# EAGLE design LPS25H_breakout (EAGLE 7.2.0)
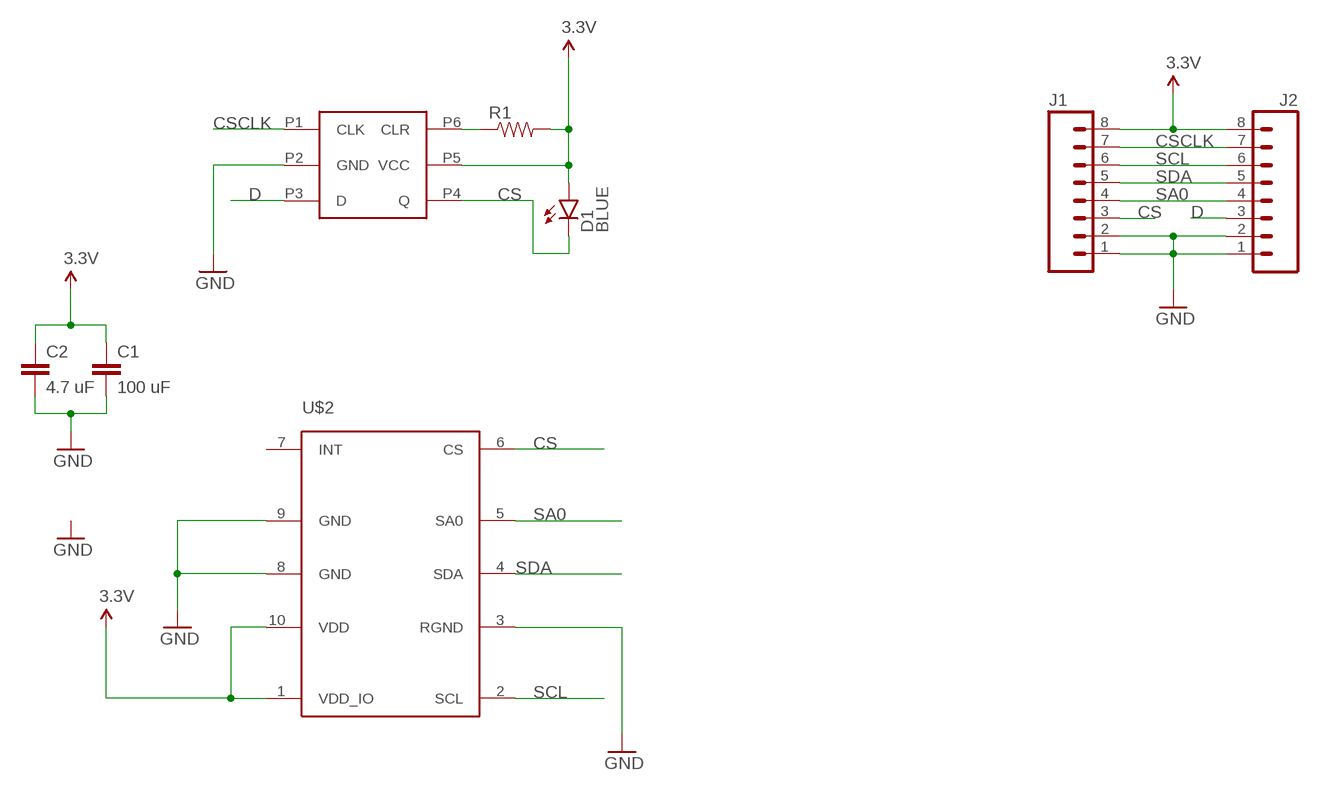
[diagram p0: schematic, sheet 1]

## Parts
C1  100 uF  CAP0603-CAP  [0603-CAP]
C2  4.7 uF  CAP0603-CAP  [0603-CAP]
D1  BLUE  LED-BLUE0603  [LED-0603]
J1  M08BM08B-SRSS-TB  [BM08B-SRSS-TB]
J2  M08BM08B-SRSS-TB  [BM08B-SRSS-TB]
R1  RESISTOR0603-RES  [0603-RES]
U$1  SN74LVC1G175  [SN74LVC1G175]
U$2  LPS25H  [LPS25H]

## Nets
3.3V: C1.1 C2.1 D1.A J1.8 J2.8 R1.2 U$1.P5(VCC) U$2.1(VDD_IO) U$2.10(VDD)
CS: D1.C J1.3 U$1.P4(Q) U$2.6(CS)
CSCLK: J1.7 J2.7 U$1.P1(CLK)
D: J2.3 U$1.P3(D)
GND: C1.2 C2.2 J1.1 J1.2 J2.1 J2.2 U$1.P2(GND) U$2.3(RGND) U$2.8(GND) U$2.9(GND)
N$1: R1.1 U$1.P6(CLR)
SA0: J1.4 J2.4 U$2.5(SA0)
SCL: J1.6 J2.6 U$2.2(SCL)
SDA: J1.5 J2.5 U$2.4(SDA)
Unconnected: U$2.7(INT)

## Library data of the parts
C1 C2 = SparkFun-Passives:CAP: Capacitor Standard 0603 ceramic capacitor, and 0.1" leaded capacitor.
D1 = SparkFun-LED:LED-BLUE: Blue LEDs for production use Various blue LEDs stocked by SparkFun production 0603 - DIO-08575 Rebel - DIO-09553 1206 - DIO-09911; PROD_ID: DIO-08575
J1 J2 = SparkFun-Connectors:M08: Header 8 Standard 8-pin 0.1" header. Use with straight break away headers (SKU : PRT-00116), right angle break away headers (PRT-00553), swiss pins (PRT-00743), machine pins (PRT-00117), and female headers (PRT-00115).
R1 = SparkFun-Passives:RESISTOR: Resistor Basic schematic elements and footprints for 0603, 1206, and PTH resistors.
U$1 = CSL_Components:SN74LVC1G175
U$2 = chips:LPS25H: ST-Micro Piezoresistive pressure sensor; DIGIKEY: 497-15070-1-ND

## Board
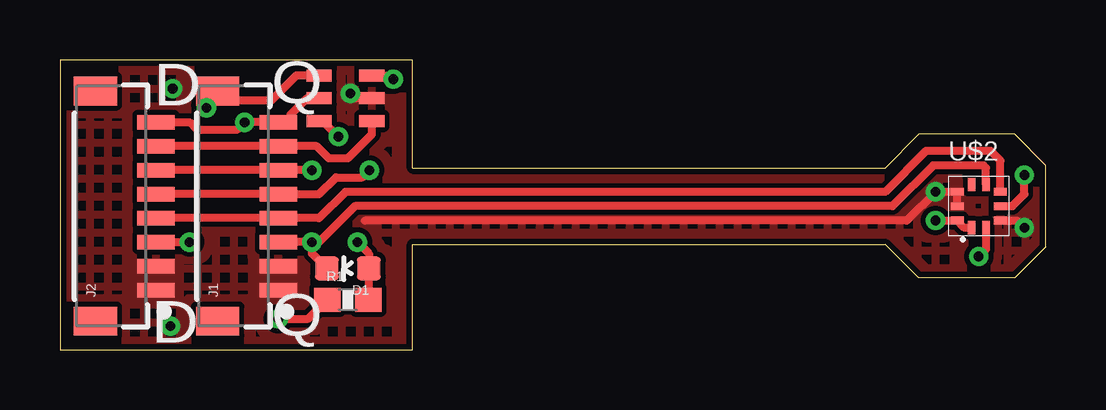
[diagram p1: board, top side]
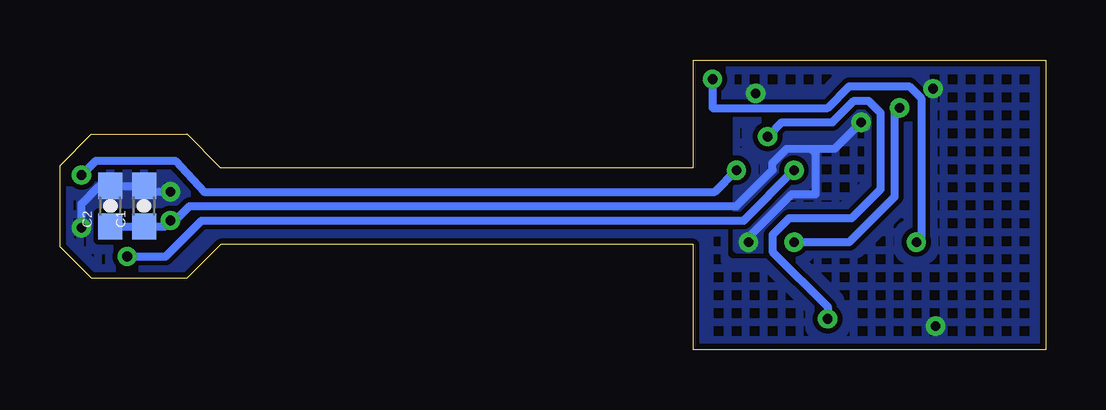
[diagram p2: board, bottom side, seen from below]

Size 41.1 x 12.1 mm. Coordinates in mm from the lower left corner, seen from the top.
Outline: 41.1,7.7 39.8,9 35.8,9 34.4,7.6 14.7,7.6 14.7,12.1 0,12.1 0,0 14.7,0 14.7,4.4 34.4,4.4 35.8,3 39.8,3 41.1,4.3 41.1,7.7
Copper layers (1*16): Top 0.035mm / dielectric 1.5mm / Bottom 0.035mm
Design rules "default *": minimum track width 10mil, minimum drill 24mil, track to track 8mil, track to pad 8mil, pad to pad 8mil, via to via 8mil, smd to smd 8mil, copper to edge 10mil, drill to drill 8mil, minimum pad ring 10mil, minimum via ring 8mil, stop-mask expansion 4mil, vias tented up to drill 0mil, thermal gap 0mil

### Footprints (pad centres in the part's own frame; a part is rotated, then mirrored left to right if it is on the bottom)
0603-CAP = smd 1.1 x 1: 1 -0.85,0; 2 0.85,0
LED-0603 = smd 1 x 1: A 0,-0.877; C 0,0.877
BM08B-SRSS-TB = smd 0.6 x 1.55: 1 -3.5,0; 2 -2.5,0; 3 -1.5,0; 4 -0.5,0; 5 0.5,0; 6 1.5,0; 7 2.5,0; 8 3.5,0 | smd 1.2 x 1.8: P$9 4.8,2.525; P$10 -4.8,2.525
0603-RES = smd 1.1 x 1: 1 -0.85,0; 2 0.85,0
SN74LVC1G175 = smd 0.5 x 1.05: P1 -0.95,-1.1; P2 0,-1.1; P3 0.95,-1.1; P4 0.95,1.1; P5 0,1.1; P6 -0.95,1.1
LPS25H = smd 0.32 x 0.55: 1 -0.3,-0.9; 2 0.3,-0.9; 6 0.3,0.9; 7 -0.3,0.9 | smd 0.55 x 0.32: 3 0.9,-0.6; 4 0.9,0; 5 0.9,0.6; 8 -0.9,0.6; 9 -0.9,0; 10 -0.9,-0.6

### Placement (x,y rotation side)
C1  37.6,6 90 bottom
C2  39,6 90 bottom
D1  12,3.4 90 top
J1  9.1,6 90 top
J2  4,6 90 top
R1  12,2.1 0 top
U$1  11.9,10.5 90 top
U$2  38.3,6 0 top

### Tracks (layer width: path | path; a pad name or v marks a point on that pad's centre or on a via)
3.3V  (via drill 0.4)
  Top 0.325: v36.5,5.4 U$2.10 37.7,5.1 U$2.1 | R1.2 12.88,2.13 D1.A 12.88,4.02 v12.4,4.5 | U$1.P5 10.3,10.5 9.6,9.8 9.6,9.6 9.2,9.6 J1.8 v7.7,9.5 7.4,9.2 5.7,9.2 5.4,9.5 J2.8
  Bottom 0.325: C2.1 C1.1 36.75,5.15 v36.5,5.4 36.3,5.4 35.7,6 12.9,6 11.4,7.5 11.4,7.8 10.8,8.4 9.8,8.4 | 9.8,8.4 8.8,8.4 v7.7,9.5 7.5,9.3 | v12.4,4.5 12.4,4.7 10.6,6.5 9.6,6.5 9.6,8.2 9.8,8.4
  pour Bottom (hatched): 7.4,10 12.9,10 12.9,4.2 7.4,4.2
CS  (via drill 0.4)
  Top 0.325: U$2.6 38.6,7.6 38.5,7.7 36.4,7.7 34.7,6 12.3,6 10.8,4.5 v10.5,4.5 | v10.5,4.5 J1.3 | D1.C 10.5,4.02 v10.5,4.5 | U$1.P4 9.85,11.45 8.8,10.4 6.4,10.4 v6.1,10.1
  Bottom 0.325: v10.5,4.5 8.2,4.5 6.3,6.4 6.3,10.2 v6.1,10.1
CSCLK
  Top 0.325: J1.7 J2.7 | J1.7 9.6,8.5 9.7,8.4 | J1.7 10.7,8.5 11.2,8 12,8 13,9 U$1.P1
D  (via drill 0.4)
  Top 0.325: J2.3 v5.4,4.5 | U$1.P3 13.65,11.45 v13.9,11.3
  Bottom 0.325: v13.9,11.3 13.9,10.1 9.1,10.1 8.2,11 5.7,11 5.2,10.5 5.2,4.7 v5.4,4.5
GND  (via drill 0.4)
  Top 0.325: U$2.9 U$2.8 v36.5,6.6 35.3,5.4 12.7,5.4 | U$2.3 39.9,5.4 v40.2,5.1 | U$1.P2 12.3,10.5 v12.1,10.7 12,10.8
  Bottom 0.325: C1.2 C2.2 39.05,6.8 39.5,6.8 40.2,6.1 v40.2,5.1 | 37.45,7 C1.2 | 37.45,6.7 C1.2 | v36.5,6.6 37.35,6.6 C1.2
  other vias: 4.6,1 4.7,10.9
  pour Bottom (rank 2, hatched): -0.9,13.6 43.3,13.6 43.3,-3.5 -0.9,-3.5
  pour Top (hatched): -0.4,15.6 42.3,15.6 42.3,-5.7 -0.4,-5.7
N$1  (via drill 0.4)
  Top 0.325: U$1.P6 10.95,9.55 v11.6,8.9 | v9.1,1.3 10.35,1.3 R1.1
  Bottom 0.325: v11.6,8.9 11,9.5 8.9,9.5 8,10.4 7.4,10.4 6.9,9.9 6.9,6.7 8.1,5.5 10.7,5.5 11.4,4.8 11.4,4.1 9.1,1.8 v9.1,1.3
SA0
  Top 0.325: U$2.5 39.2,7.9 38.8,8.3 36.1,8.3 34.4,6.6 11.9,6.6 10.8,5.5 J1.4 J2.4
SCL  (via drill 0.4)
  Top 0.325: U$2.2 38.6,4.2 v38.3,3.9 | v10.5,7.5 J1.6 J2.6
  Bottom 0.325: v38.3,3.9 36.7,3.9 35.2,5.4 12.6,5.4 v10.5,7.5
SDA  (via drill 0.4)
  Top 0.325: U$2.4 39.7,6 40.2,6.5 v40.2,7.3 | J2.5 J1.5 10.8,6.5 11.5,7.2 12.6,7.2 v12.9,7.5
  Bottom 0.325: v40.2,7.3 39.6,7.9 36.3,7.9 35.1,6.6 13.8,6.6 v12.9,7.5

### Text on the board
tPlace: D | Q | Q | D